# EAGLE design untitled (EAGLE 9.6.2)
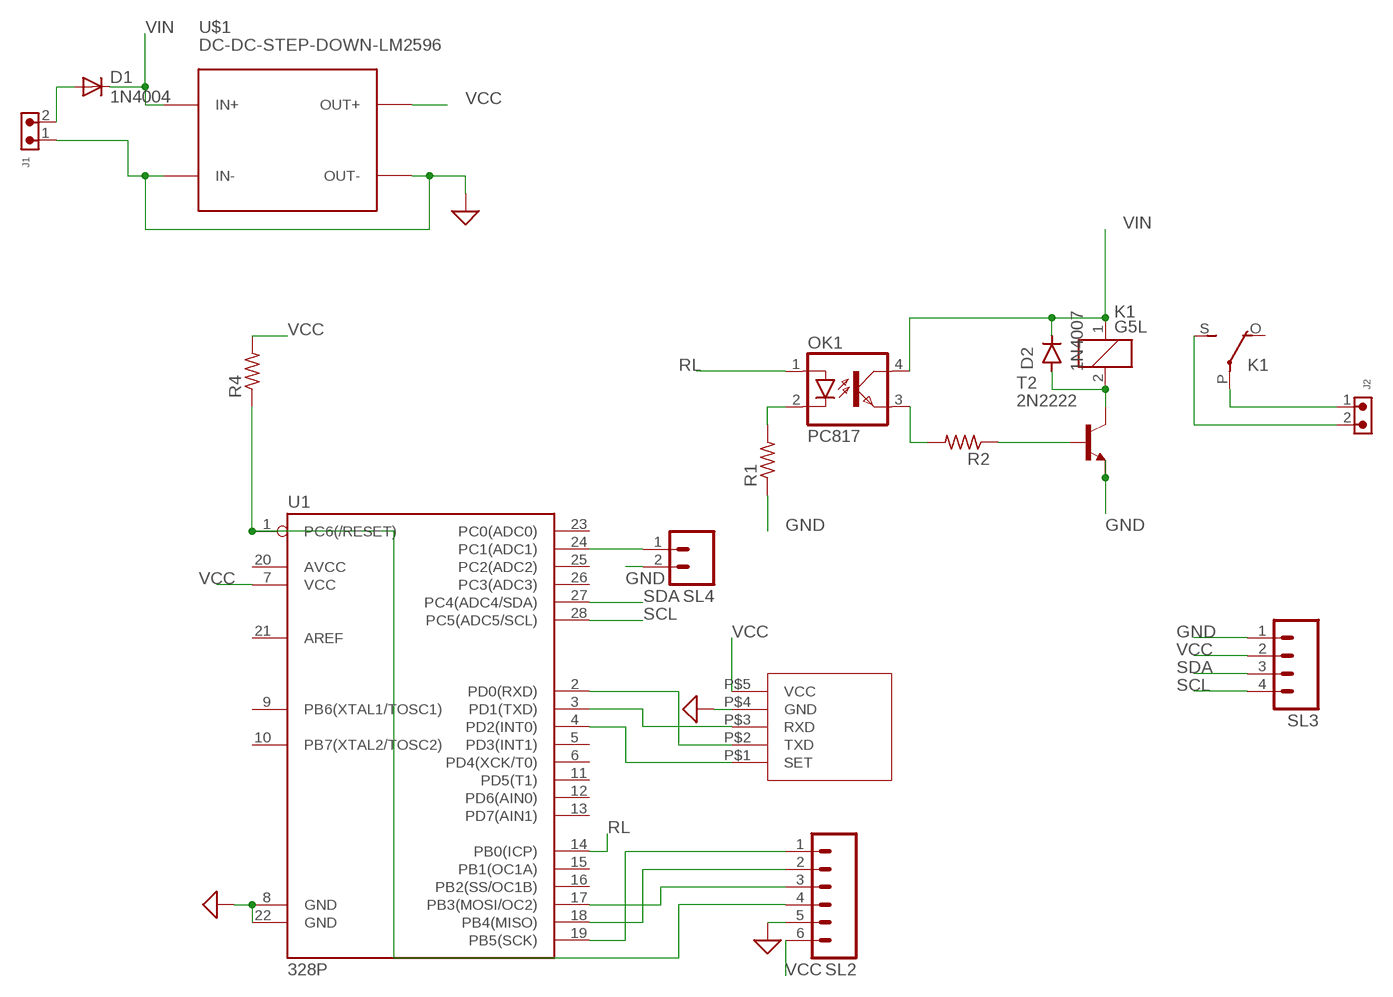
[diagram p0: schematic, sheet 1]

## Parts
D1  1N4004  [DO41-10]
D2  1N4007  [DO-41]
J1  691305530002  691305530002  [691305530002]
J2  691305530002  691305530002  [691305530002]
K1  G5L  [G5LE]
OK1  PC817  [DIL04]
R1  R-US_0207/7  [0207/7]
R2  R-US_0207/12  [0207/12]
R4  R-US_0207/7  [0207/7]
SL2  M06  [06P]
SL3  M04  [04P]
SL4  M02  [02P]
T2  2N2222  [TO92-EBC-OVAL]
U1  328P  ATMEGA328P_PDIP  [DIP28]
U$1  DC-DC-STEP-DOWN-LM2596  [DC-DC-STEP-DOWN-LM2596]
U$3  HC12  [HC12]

## Nets
GND: J1.1 R1.1 SL2.5 SL3.1 SL4.2 T2.E U1.8(GND) U1.22(GND) U$1.IN- U$1.OUT- U$3.P$4(GND) ; supply symbol labelled SUP
N$1: D1.A J1.2
N$3: U1.2(PD0(RXD)) U$3.P$2(TXD)
N$4: SL2.1 U1.19(PB5(SCK))
N$5: SL2.2 U1.18(PB4(MISO))
N$6: SL2.3 U1.17(PB3(MOSI/OC2))
N$7: U1.3(PD1(TXD)) U$3.P$3(RXD)
N$8: U1.4(PD2(INT0)) U$3.P$1(SET)
N$9: R2.1 T2.B
N$10: D2.A K1.2 T2.C
N$11: OK1.2(C) R1.2
N$12: J2.1 K1.P(2:P)
N$13: OK1.3(EMIT) R2.2
N$14: R4.1 SL2.4 U1.1(PC6(/RESET))
N$15: SL4.1 U1.24(PC1(ADC1))
N$16: J2.2 K1.S(2:S)
RL: OK1.1(A) U1.14(PB0(ICP))
SCL: SL3.4 U1.28(PC5(ADC5/SCL))
SDA: SL3.3 U1.27(PC4(ADC4/SDA))
VCC: R4.2 SL2.6 SL3.2 U1.7(VCC) U$1.OUT+ U$3.P$5(VCC)
VIN: D1.C D2.C K1.1 OK1.4(COL) U$1.IN+
Unconnected: K1.O(2:O) U1.5(PD3(INT1)) U1.6(PD4(XCK/T0)) U1.9(PB6(XTAL1/TOSC1)) U1.10(PB7(XTAL2/TOSC2)) U1.11(PD5(T1)) U1.12(PD6(AIN0)) U1.13(PD7(AIN1)) U1.15(PB1(OC1A)) U1.16(PB2(SS/OC1B)) U1.20(AVCC) U1.21(AREF) U1.23(PC0(ADC0)) U1.25(PC2(ADC2)) U1.26(PC3(ADC3))

## Library data of the parts
D1 = adafruit:1N4004: DIODE General purpose 1N400x type rectifier (With bigger pads) http://www.ladyada.net/library/pcb/eaglelibrary.html
D2 = Diodes:1N4007: DIODE GEN PURP 1KV 1A DO41 Manufacturer's datasheet <https://www.mccsemi.com/pdf/Products/1N4001-1N4007(DO-41).pdf>; CREATED_BY: PCBLayout.com; DIGIKEY_PART_NUMBER: 1N4007MSCT-ND; MANUFACTURER: Micro Commercial Co; MPN: 1N4007; PACKAGE: DO-41
J1 J2 = Wurth_Connectors_WR-TBL Pluggable Connector:691305530002: WR-TBL Serie 3055 - 5,08 mm - PCB Header Vertical Entry with Plastic Latches KIND PROPERTIES Pitch 5.08 mm MATERIAL PROPERTIES Insulator Material PA66 Insulator Flammability Rating UL94 V-0 Insulator Color Green Terminal Material Copper Alloy Terminal Plating Tin-plated surface GENERAL INFORMATION Operating Temperature -40 up to +105 °C ELECTRICAL PROPERTIES IR UL 16 A Working Voltage [UL] 300 V (AC) Withstanding Voltage [UL] 2500 V (AC) Contact Resistance [UL] 20 mΩ CERTIFICATION UL Approval E315414 <https://www.we-online.com/catalog/media/o135349v209%20Family_WR-TBL3_6913055300xx.jpg> Details see: https://www.we-online.com/catalog/en/TBL_5_08_3055_6913055300XX/ Updated by Ella Wu 2019-12-30 2019(C) Wurth Elektronik; DATASHEET-URL: https://www.we-online.com/catalog/datasheet/691305530002.pdf; IR-UL: 16A; MOUNT: THT; PART-NUMBER: 691305530002; PINS: 2; PITCH: 5.08mm; TYPE: Vertical; WORKING-VOLTAGE-UL: 300V (AC)
K1 = relay:G5L: RELAY 1 x switch, 10 A/120 V AC, 8 A/30 V ADC, Omron; OC_FARNELL: unknown; OC_NEWARK: unknown
OK1 = optocoupler:PC817: SHARP OPTO COUPLER; MPN: PC817X4J000F; OC_FARNELL: 9707727; OC_NEWARK: 97K7059
R1 R2 R4 = adafruit:R-US_: RESISTOR, American symbol
SL2 = con-amp-quick:M06: AMP QUICK CONNECTOR; OC_FARNELL: unknown; OC_NEWARK: unknown
SL3 = con-amp-quick:M04: AMP QUICK CONNECTOR; OC_FARNELL: unknown; OC_NEWARK: unknown
SL4 = con-amp-quick:M02: AMP QUICK CONNECTOR; OC_FARNELL: unknown; OC_NEWARK: unknown
T2 = adafruit:2N2222: NPN TRANSISTOR Big oval pads
U1 = SparkFun-IC-Microcontroller:ATMEGA328P_PDIP: Atmel 328P Through hole ATMEGA328P uC used in the Arduino 32kb flash, 1k EEPROM, 2k SRAM Datasheet <http://www.sparkfun.com/datasheets/Components/SMD/ATMega328.pdf> SparkFun Products Storefront component: AVR 28 Pin 20MHz 32K 6A/D - ATMega328P <https://www.sparkfun.com/products/9061> (COM-09061) SparkFun Simon Says - Through-Hole Soldering Kit <https://www.sparkfun.com/products/10547> (KIT-10547) SparkFun Learn to Solder - Simon Says <https://www.sparkfun.com/products/13708> (KIT-13708) SparkFun BigTime Watch Kit <https://www.sparkfun.com/products/11734> (KIT-11734) SparkFun ClockIt <https://www.sparkfun.com/products/10930> (KIT-10930) SparkFun Serial Enabled LCD Kit <https://www.sparkfun.com/products/10097> (LCD-10097) SparkFun Simon Tilts - Through Hole Soldering Kit <https://www.sparkfun.com/products/12634> (KIT-12634) SparkFun Frequency Counter Kit <https://www.sparkfun.com/products/10140> (KIT-10140) FabFM Radio Kit <https://www.sparkfun.com/products/11043> (KIT-11043) SparkFun Binary Blaster Kit <https://www.sparkfun.com/products/12037> (KIT-12037) SparkFun Metro-Gnome <https://www.sparkfun.com/products/9236> (KIT-09236) ATmega328 with Arduino Optiboot (Uno) <https://www.sparkfun.com/products/10524> (DEV-10524); PROD_ID: IC-09136
U$1 = diy-modules:DC-DC-STEP-DOWN-LM2596: DC/DC Step-Down Regulator based on LM2596-ADJ chip LM2596 datasheet available here: http://www.ti.com/lit/ds/symlink/lm2596.pdf Click here to find device on ebay.com <http://www.ebay.com/sch/lm2596+power+regulator>
U$3 = techart:HC12

## Board
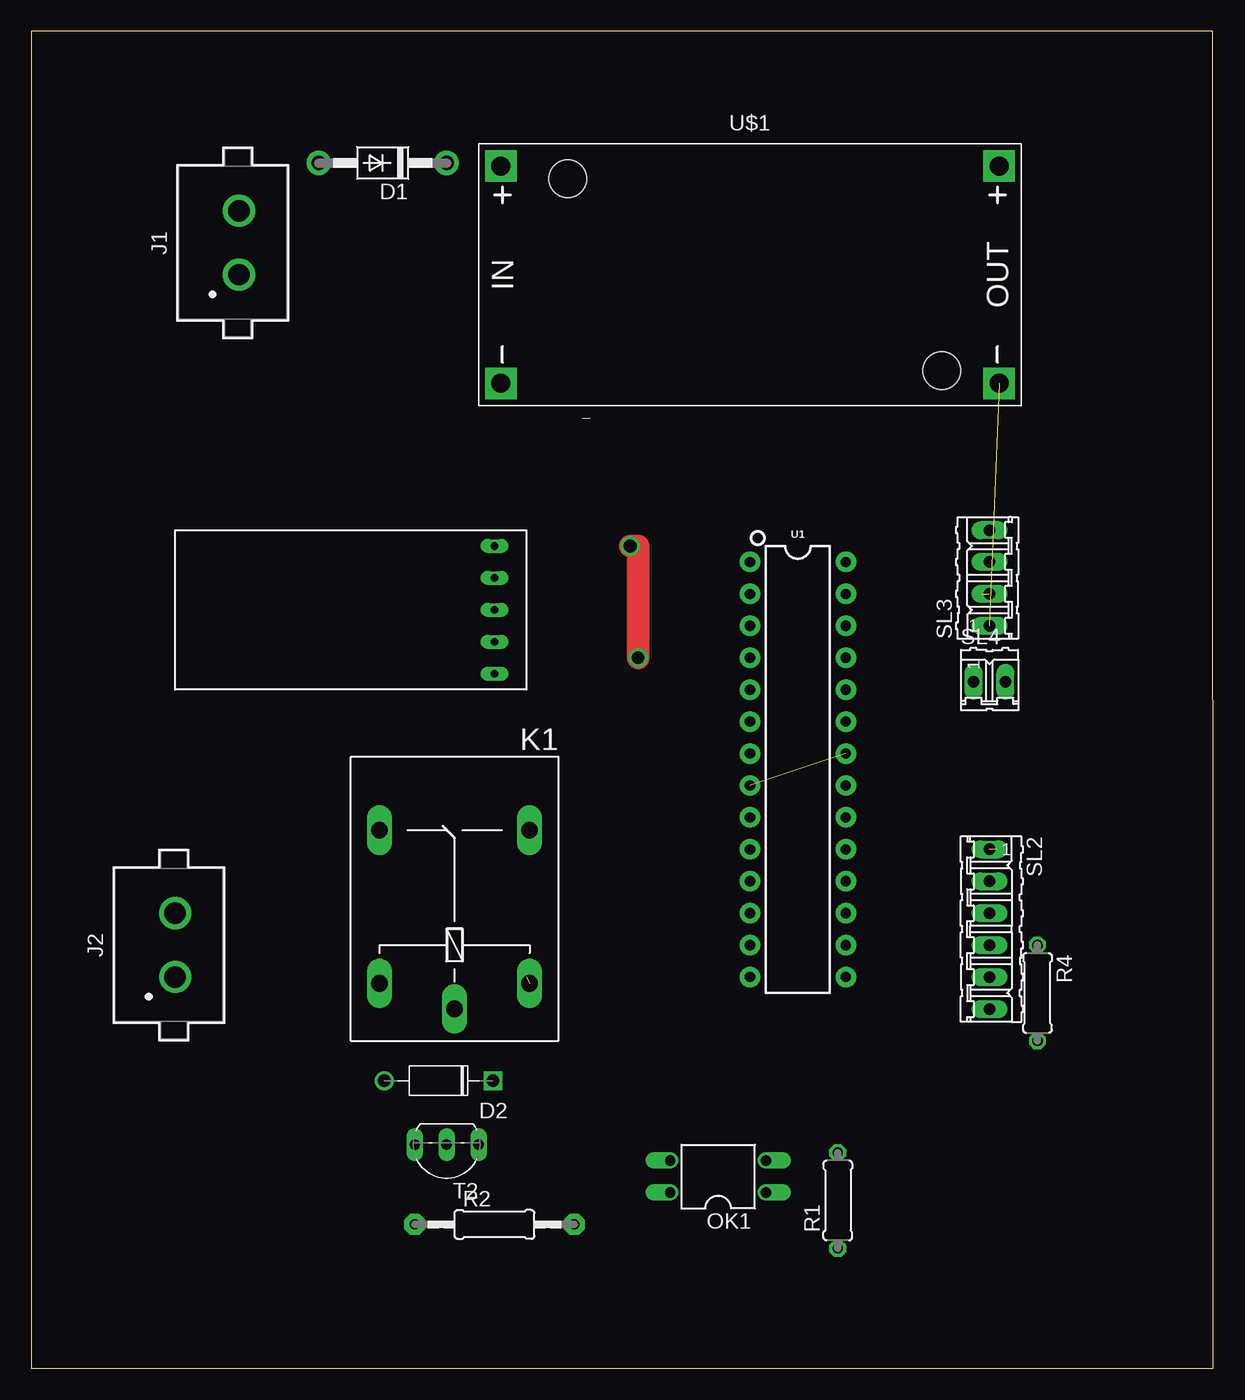
[diagram p1: board, top side]
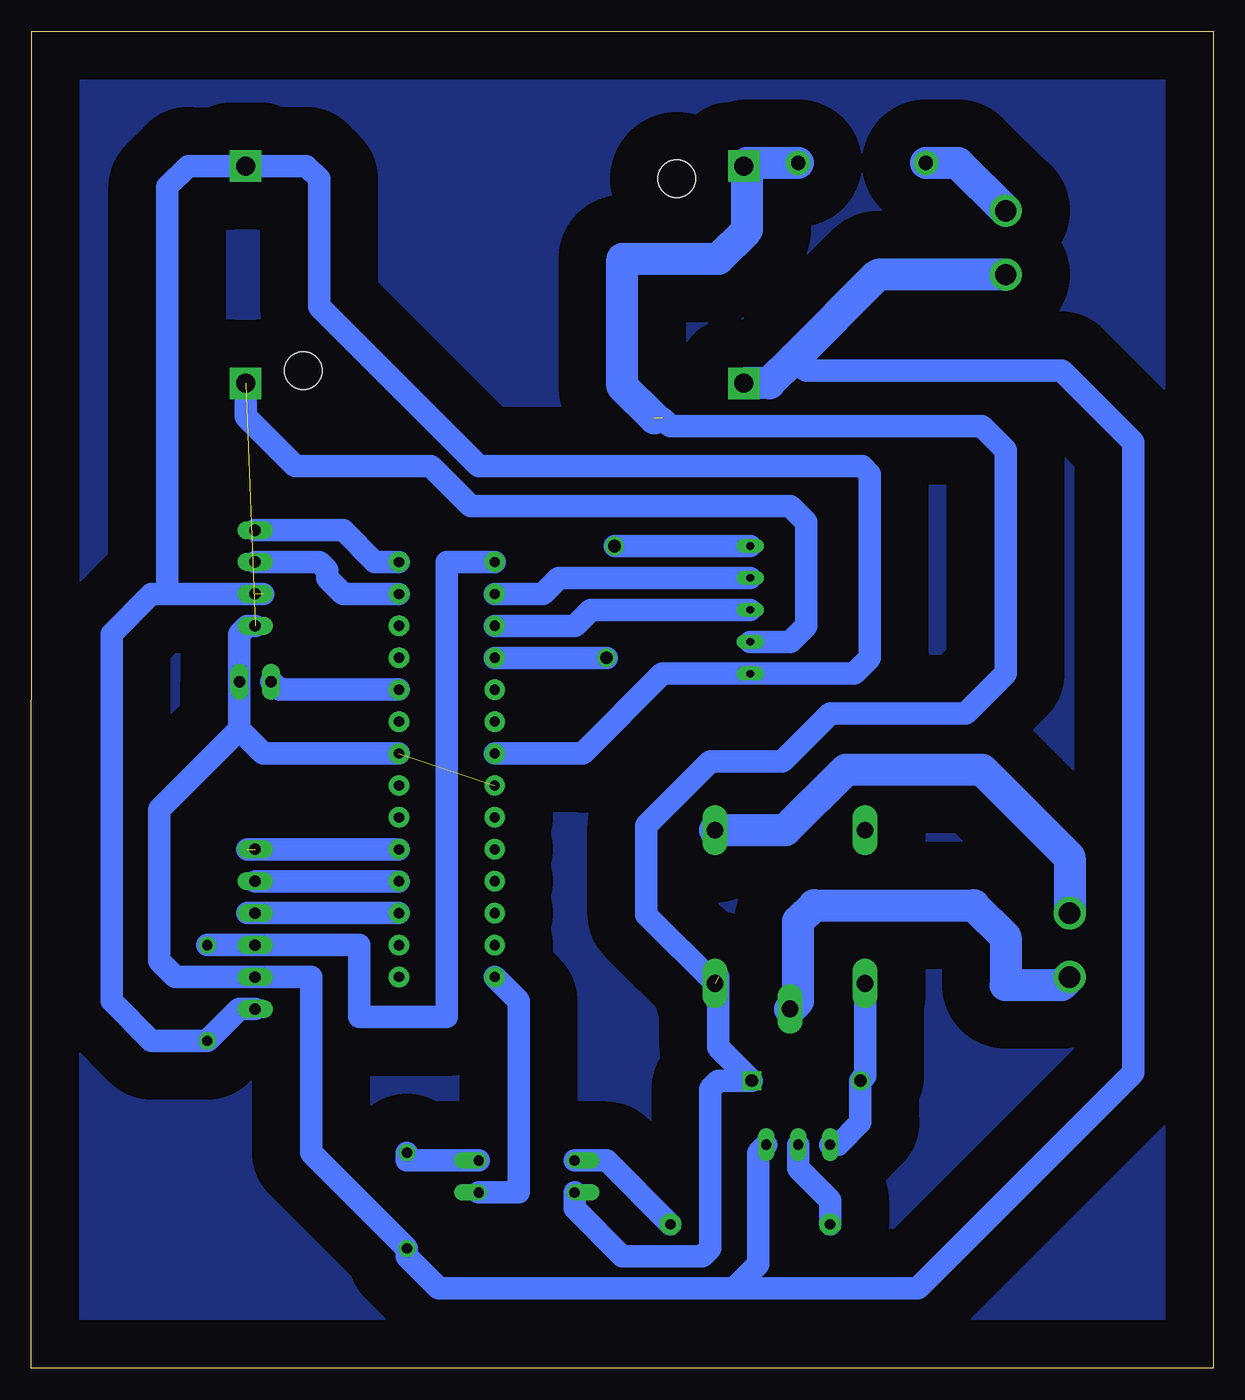
[diagram p2: board, bottom side, seen from below]

Size 94 x 106.35 mm. Coordinates in mm from the lower left corner, seen from the top.
Outline: 0,0 94,0 93.96,106.35 0,106.35 0,0
Copper layers (1*16): Top 0.035mm / dielectric 1.5mm / Bottom 0.035mm
Design rules "default *": minimum track width 6mil, minimum drill 0.35mm, track to track 30mil, track to pad 30mil, pad to pad 30mil, via to via 30mil, smd to smd 6mil, copper to edge 40mil, drill to drill 6mil, minimum pad ring 10mil, minimum via ring 8mil, stop-mask expansion 4mil, vias tented up to drill 0mil, thermal gap 10mil

### Footprints (pad centres in the part's own frame; a part is rotated, then mirrored left to right if it is on the bottom)
DO41-10 = drill 1.118 pad 1.93: A 5.08,0; C -5.08,0
DO-41 = drill 1: A 4.325,0 | drill 1 square: C -4.325,0
691305530002 = drill 1.7: 1 -2.54,0; 2 2.54,0
G5LE = drill 1.321 long: 1 -7.493,-5.969; 2 -7.493,5.969; O 4.699,5.969; P -9.525,0; S 4.699,-5.969
DIL04 = drill 0.813 offset: 1 -1.27,-3.81; 2 1.27,-3.81; 3 1.27,3.81; 4 -1.27,3.81
0207/7 = drill 0.813 octagon: 1 -3.81,0; 2 3.81,0
0207/12 = drill 0.813 pad 1.676 octagon: 1 -6.35,0; 2 6.35,0
06P = drill 0.914 long: 1 -6.35,0; 2 -3.81,0; 3 -1.27,0; 4 1.27,0; 5 3.81,0; 6 6.35,0
04P = drill 0.914 long: 1 -3.81,0; 2 -1.27,0; 3 1.27,0; 4 3.81,0
02P = drill 0.914 long: 1 -1.27,0; 2 1.27,0
TO92-EBC-OVAL = drill 0.813 long: B 0,-1.27; C 2.54,-1.27; E -2.54,-1.27
DIP28 = drill 0.813 pad 1.626: 1 -16.51,-3.81; 2 -13.97,-3.81; 3 -11.43,-3.81; 4 -8.89,-3.81; 5 -6.35,-3.81; 6 -3.81,-3.81; 7 -1.27,-3.81; 8 1.27,-3.81; 9 3.81,-3.81; 10 6.35,-3.81; 11 8.89,-3.81; 12 11.43,-3.81; 13 13.97,-3.81; 14 16.51,-3.81; 15 16.51,3.81; 16 13.97,3.81; 17 11.43,3.81; 18 8.89,3.81; 19 6.35,3.81; 20 3.81,3.81; 21 1.27,3.81; 22 -1.27,3.81; 23 -3.81,3.81; 24 -6.35,3.81; 25 -8.89,3.81; 26 -11.43,3.81; 27 -13.97,3.81; 28 -16.51,3.81
DC-DC-STEP-DOWN-LM2596 = drill 1.5 pad 2.5 square: IN+ -19.812,8.636; IN- -19.812,-8.636; OUT+ 19.812,8.636; OUT- 19.812,-8.636 | hole 3: -14.478,7.62; 15.24,-7.62
HC12 = drill 0.6 long: P$1 5.08,5.08; P$2 5.08,2.54; P$3 5.08,0; P$4 5.08,-2.54; P$5 5.08,-5.08

### Placement (x,y rotation side)
D1  27.94,95.89 180 top
D2  32.38,22.86 180 top
J1  16.51,89.53 90 top
J2  11.43,33.66 90 top
K1  33.66,38.1 90 top
OK1  54.61,15.24 90 top
R1  64.14,13.33 90 top
R2  36.83,11.43 0 top
R4  80.01,29.85 270 top
SL2  76.2,34.93 270 top
SL3  76.2,62.87 90 top
SL4  76.2,54.61 0 top
T2  33.02,16.51 180 top
U1  60.96,47.62 270 top
U$1  57.15,87 0 top
U$3  31.75,60.33 0 top

### Tracks (layer width: path | path; a pad name or v marks a point on that pad's centre or on a via)
GND  (2 unrouted)
  Bottom 1.778: U1.22 75.56,48.9 77.47,50.8 | 77.47,50.8 SL4.2 77.47,58.42 76.84,59.05 SL3.1 | T2.E 36.2,17.14 36.2,8.25 38.1,6.35 | 77.47,50.8 83.82,44.45 83.82,32.38 82.55,31.12 SL2.5 71.75,31.12 71.75,17.14 R1.1 64.14,8.89 61.59,6.35 40.01,6.35 38.1,6.35 | U$3.P$4 33.66,57.79 32.38,59.05 32.38,67.31 33.66,68.58 59.05,68.58 62.23,71.75 73.03,71.75 76.96,75.69 U$1.OUT- | 33.34,80.33 32.38,79.38 12.07,79.38 6.35,73.66 6.35,23.5 23.49,6.35 38.1,6.35
  Bottom 2.54: J1.1 26.67,87 33.34,80.33 35.31,78.36 U$1.IN-
N$1
  Bottom 2.54: J1.2 20.32,95.89 D1.A
N$2
  pour Bottom (isolate 3.81): 0,106.05 93.98,106.05 93.98,0 0,0
N$3
  Bottom 1.778: U$3.P$2 52.07,62.87 53.34,61.59 U1.2
N$4  (1 unrouted)
  Bottom 1.778: U1.19 76.84,41.27
N$5
  Bottom 1.778: SL2.2 U1.18
N$6
  Bottom 1.778: U1.17 SL2.3 76.84,36.2
N$7
  Bottom 1.778: U1.3 50.8,59.05 49.53,60.33 U$3.P$3
N$8  (via drill 1)
  Top 1.778: v48.26,56.52 48.26,65.41 v47.62,65.41
  Bottom 1.778: U1.4 v48.26,56.52 | v47.62,65.41 U$3.P$1
N$9
  Bottom 1.778: T2.B 33.02,15.88 30.48,13.33 R2.1
N$10
  Bottom 1.778: K1.2 27.69,23.23 D2.A 28.06,19.57 29.84,17.78 T2.C
N$11
  Bottom 1.778: OK1.2 64.14,16.51 R1.2
N$12
  Bottom 2.54: K1.P 33.02,29.21 33.02,35.56 31.75,36.83 19.05,36.83 16.51,34.29 16.51,30.48 12.07,30.48 J2.1
N$13
  Bottom 1.778: OK1.3 48.26,16.51 R2.2
N$14
  Bottom 1.778: R4.1 SL2.4 67.95,33.66 67.95,27.94 60.96,27.94 60.96,64.13 U1.1
N$15
  Bottom 1.778: SL4.1 74.3,53.98 U1.24
N$16
  Bottom 2.54: K1.S 34.04,42.8 29.21,47.62 18.41,47.62 11.43,40.64 J2.2
RL
  Bottom 1.778: OK1.1 55.25,13.97 55.25,29.21 U1.14
SCL
  Bottom 1.778: U1.28 66.67,64.13 69.22,66.67 SL3.4
SDA
  Bottom 1.778: U1.27 69.22,61.59 70.48,62.87 70.48,63.5 71.12,64.13 SL3.3
VCC  (1 unrouted)
  Bottom 1.778: SL2.6 77.47,28.58 R4.2 84.45,26.04 87.63,29.21 87.63,58.42 84.45,61.59 83.19,61.59 | 83.19,61.59 75.56,61.59 | U1.7 50.16,48.9 43.82,55.25 U$3.P$5 28.57,55.25 27.3,56.52 27.3,71.12 27.94,71.75 43.82,71.75 44.45,71.75 58.42,71.75 71.12,84.45 71.12,94.61 72.14,95.63 U$1.OUT+ 81.53,95.63 83.19,93.98 83.19,61.59
VIN  (2 unrouted)
  Bottom 1.778: 39.37,31.12 39.37,25.52 D2.C 39.37,22.86 40.01,22.23 40.01,9.53 40.64,8.89 46.99,8.89 50.8,12.7 OK1.4 | K1.1 45.09,36.07 45.09,43.18 40.01,48.26 36.2,48.26 35.56,48.26 34.29,48.26 30.48,52.07 19.68,52.07 16.51,55.25 16.51,73.03 18.41,74.93 43.18,74.93 43.82,75.56
  Bottom 2.54: D1.C 37.08,95.89 | 37.08,95.89 U$1.IN+ | 44.45,75.56 46.99,78.11 46.99,88.27 39.37,88.27 37.08,90.55 37.08,95.89